# Altium schematic sheet TDII_PWR_R00.SchDoc
size A4
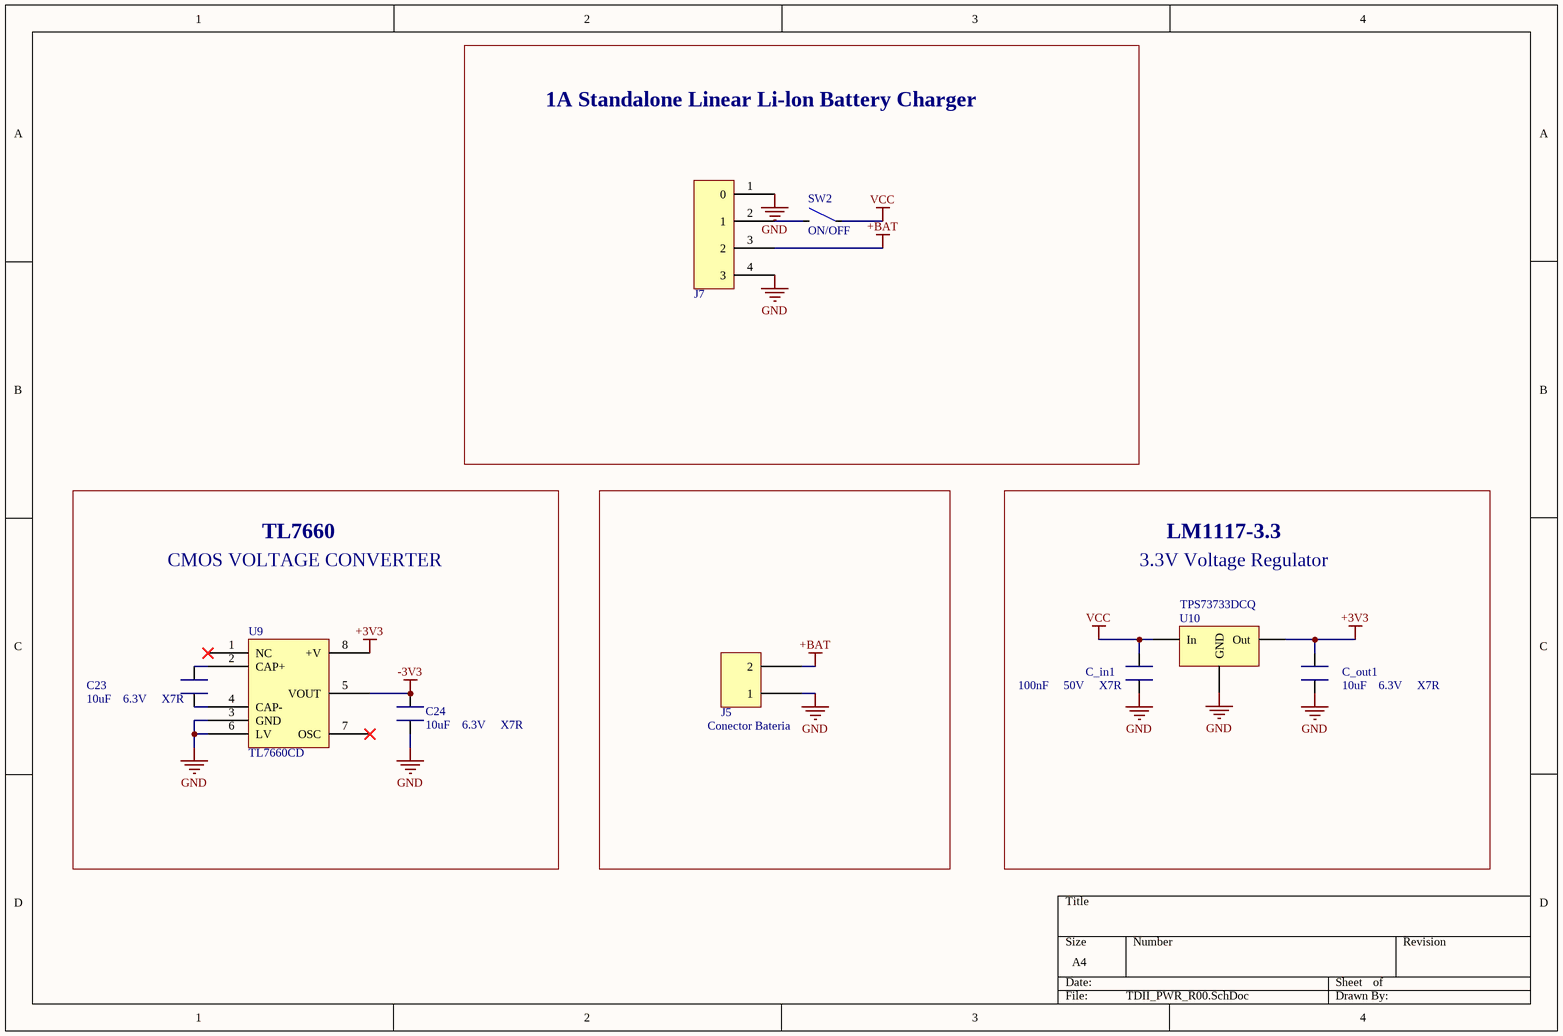
[diagram p0: TDII_PWR_R00.SchDoc]

## Parts
C23  10uF    6.3V     X7R  [C_0805]
C24  10uF    6.3V     X7R  [C_0805]
C_in1  100nF     50V     X7R  [C_0805]
C_out1  10uF    6.3V     X7R  [C_0805]
J5  Conector Bateria  [HEADER_1x2]
J7  Conector 0.100" - 4 pines  [HEADER_CHARGER]  (value not drawn)
SW2  ON/OFF  [HEADER_1x2]
U9  TL7660CD  [SOI8]
U10  TPS73733DCQ  [SOT-223-4]

## Blocks framed on the sheet
1A Standalone Linear Li-lon Battery Charger: J7 SW2
TL7660: C23 C24 U9
LM1117-3.3: C_in1 C_out1 U10

## Nets
+3V3: C_out1.1 U9.8(+V) U10.2(Out)
+BAT: J5.1(2) J7.3(2)
-3V3: C24.1 U9.5(VOUT)
GND: C24.2 C_in1.2 C_out1.2 J5.2(1) J7.1(0) J7.4(3) U9.3(GND) U9.6(LV) U10.1(GND)
VCC: C_in1.1 SW2.2 U10.3(In)
NetC23_1: C23.1 U9.2(CAP+)
NetC23_2: C23.2 U9.4(CAP-)
NetJ7_2: J7.2(1) SW2.1

Not connected (* = marked no-connect by the designer): U9 1(NC)* 7(OSC)*

## Notes on the sheet
- CMOS VOLTAGE CONVERTER
- 3.3V Voltage Regulator

## Library data of the parts
C23 C24 C_in1 C_out1 = CAP
J5 = Conector_2 ( 0.100")
SW2 = SWITCH: Switch, generic
U9 = TL7660
U10 = TLV1117-33CKVURG3: LDO Voltage Regulators Sgl Output LDO 800mA Fixed Int Crnt limit; Manufacturer: Texas Instruments; Input Bias Current - Max: 5 mA; Input Voltage MAX: 15 V; Number of Outputs: 1 Output; Output Voltage: 3.3 V; Dropout Voltage - Max: 1.2 V at 100 mA, 1.25 V at 500 mA, 1.3 V at 800 mA; Input Voltage MIN: + 4.7 V; Line Regulation: 0.2 %; Load Regulation: 0.4 %; Supplier 1: Mouser; RoHS: RoHS Compliant; Category: LDO Voltage Regulators; Stock 1: 2731; Pricing 1: 1=0.624, 10=0.496, 100=0.370, 500=0.272, 1000=0.248, 2500=0.210, 10000=0.202 (EUR); Output Current: 800 mA; Output Type: Fixed; Package/Case: TO-252-3; Packaging: Reel; Series: TLV1117-33; Mounting Style: SMD/SMT; Maximum Operating Temperature: + 125 C; Minimum Operating Temperature: 0 C; Product Category: Regulators - Standard; Standard Pack Qty: 2500; RoHS - Mouser: Y; Minimum Order Quantity: 1; Reeling: True; ComponentLink1URL: http://www.ti.com/litv/slvs561k; ComponentLink1Description: http://www.ti.com/litv/slvs561k; Supplier Part Number 1: 595-TLV111733CKVURG3